# Altium schematic sheet A.SchDoc
size A
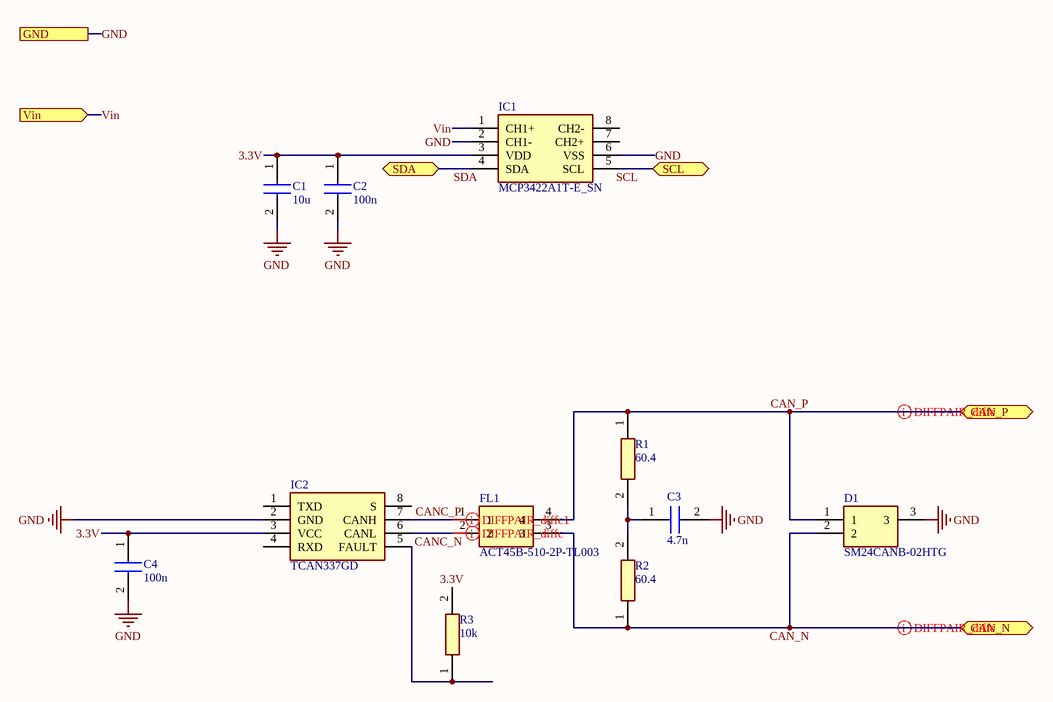
[diagram p0: A.SchDoc]

## Parts
C1  10u  [CAPC1608X90N]
C2  100n  [CAPC1608X90N]
C3  4.7n  [CAPC1608X95N]
C4  100n  [CAPC1608X90N]
D1  SM24CANB-02HTG  [SM24CANB02HTG]
FL1  ACT45B-510-2P-TL003  [ACT45B1012PTL003]
IC1  MCP3422A1T-E_SN  [SOIC127P600X175-8N]
IC2  TCAN337GD  [SOIC127P600X175-8N]
R1  60.4  [RESC1608X50N]
R2  60.4  [RESC1608X50N]
R3  10k  [RESC1608X55N]

## Ports
CAN_N (bidir), CAN_P (bidir), GND, SCL (bidir), SDA (bidir), Vin (in)

## Nets
GND: C1.2 C2.2 C3.2 C4.2 D1.3 IC1.2(CH1-) IC1.6(VSS) IC2.2(GND) ; port GND
3.3V: C1.1 C2.1 C4.1 IC1.3(VDD) IC2.3(VCC) R3.2
CAN_N: D1.2 FL1.3 R2.1 ; port CAN_N
CAN_P: D1.1 FL1.4 R1.1 ; port CAN_P
CANC_N: FL1.2 IC2.6(CANL)
CANC_P: FL1.1 IC2.7(CANH)
SCL: IC1.5(SCL) ; port SCL
SDA: IC1.4(SDA) ; port SDA
Vin: IC1.1(CH1+) ; port Vin
NetC3_1: C3.1 R1.2 R2.2
NetIC2_5: IC2.5(FAULT) R3.1

Not connected (* = marked no-connect by the designer): IC1 7(CH2+) 8(CH2-); IC2 1(TXD) 4(RXD) 8(S)

## Layout directives
differential pair; differential pair class diffc; differential pair: CAN_N, CAN_P, CANC_N
differential pair; differential pair class diffc1; differential pair: CANC_P

## Library data of the parts
C1 = CL10A106KQ8NNNL: Capacitor; Manufacturer_Name: SAMSUNG; Datasheet Link: https://product.samsungsem.com/mlcc/basic-search.do?partNumber=CL10A106KQ8NNN; Height: 0.9mm; Manufacturer_Part_Number: CL10A106KQ8NNNL; Mouser Part Number: N/A; Mouser Price/Stock: https://www.mouser.com/Search/Refine.aspx?Keyword=N%2FA; Arrow Part Number: CL10A106KQ8NNNL; Arrow Price/Stock: https://www.arrow.com/en/products/cl10a106kq8nnnl/samsung-electro-mechanics
C2 C4 = 06035C104J4Z2A: Capacitor; Manufacturer_Name: Kyocera AVX; Datasheet Link: https://componentsearchengine.com/Datasheets/1/06031A100FAT2A.pdf; Height: 0.9mm; Manufacturer_Part_Number: 06035C104J4Z2A; Mouser Part Number: 581-06035C104J4Z2A; Mouser Price/Stock: https://www.mouser.co.uk/ProductDetail/KYOCERA-AVX/06035C104J4Z2A?qs=Awwwc1gvTnlncvTGCFZvkw%3D%3D; Arrow Part Number: 06035C104J4Z2A; Arrow Price/Stock: https://www.arrow.com/en/products/06035c104j4z2a/avx
C3 = 0603B472M500CT: Capacitor; Manufacturer_Name: Walsin Technology Corporation; Datasheet Link: https://www.passivecomponent.com/wp-content/uploads/datasheet/WTC_MLCC_General_Purpose.pdf; Height: 0.95mm; Manufacturer_Part_Number: 0603B472M500CT
D1 = SM24CANB-02HTG: TVS Diode (Bi-directional); Manufacturer_Name: LITTELFUSE; Datasheet Link: https://www.littelfuse.com/products/overvoltage-protection/tvs-diode-arrays/general-purpose/sm24canb/sm24canb-02htg; Height: 1.12mm; Manufacturer_Part_Number: SM24CANB-02HTG; Mouser Part Number: 576-SM24CANB-02HTG; Mouser Price/Stock: https://www.mouser.co.uk/ProductDetail/Littelfuse/SM24CANB-02HTG?qs=bWsWnctWn1wbKmCYlcUmHw%3D%3D; Arrow Part Number: SM24CANB-02HTG; Arrow Price/Stock: https://www.arrow.com/en/products/sm24canb-02htg/littelfuse?utm_currency=USD&region=nac
FL1 = ACT45B-510-2P-TL003: Filter; Manufacturer_Name: TDK; Datasheet Link: https://product.tdk.com/system/files/dam/doc/product/emc/emc/cmf_cmc/catalog/cmf_automotive_signal_act45b_en.pdf; Height: 3mm; Manufacturer_Part_Number: ACT45B-510-2P-TL003; Mouser Part Number: 810-ACT45B5102PTL003; Mouser Price/Stock: https://www.mouser.co.uk/ProductDetail/TDK/ACT45B-510-2P-TL003?qs=U1cgCdF9Le9LCroNYLqljw%3D%3D; Arrow Part Number: ACT45B-510-2P-TL003; Arrow Price/Stock: https://www.arrow.com/en/products/act45b-510-2p-tl003/tdk?utm_currency=USD&region=nac
IC1 = MCP3422A1T-E_SN: Integrated Circuit; Manufacturer_Name: Microchip; Manufacturer_Part_Number: MCP3422A1T-E/SN; Datasheet Link: https://ww1.microchip.com/downloads/en/DeviceDoc/22088c.pdf; Height: 1.75mm; Mouser Part Number: 579-MCP3422A1T-E/SN; Mouser Price/Stock: https://www.mouser.co.uk/ProductDetail/Microchip-Technology/MCP3422A1T-E-SN?qs=X98pPdo4MrvBbe3HwfJ%252Bfw%3D%3D; Arrow Part Number: MCP3422A1T-E/SN; Arrow Price/Stock: https://www.arrow.com/en/products/mcp3422a1t-esn/microchip-technology
IC2 = TCAN337GD: Integrated Circuit; Manufacturer_Name: Texas Instruments; Datasheet Link: https://www.arrow.com/en/products/tcan337gd/texas-instruments; Height: 1.75mm; Manufacturer_Part_Number: TCAN337GD; Mouser Part Number: 595-TCAN337GD; Mouser Price/Stock: https://www.mouser.co.uk/ProductDetail/Texas-Instruments/TCAN337GD?qs=gMfM3zrbS4qmjQESf%252BTgJw%3D%3D; Arrow Part Number: TCAN337GD; Arrow Price/Stock: https://www.arrow.com/en/products/tcan337gd/texas-instruments?region=europe
R1 R2 = CRCW060360R4FKEA: Resistor; Manufacturer_Name: Vishay; Datasheet Link: http://www.vishay.com/docs/20035/dcrcwe3.pdf; Height: 0.5mm; Manufacturer_Part_Number: CRCW060360R4FKEA; Mouser Part Number: 71-CRCW0603-60.4-E3; Mouser Price/Stock: https://www.mouser.co.uk/ProductDetail/Vishay-Dale/CRCW060360R4FKEA?qs=6fyMJ9%2FiJ9KMVX8MBWVfDg%3D%3D; Arrow Part Number: CRCW060360R4FKEA; Arrow Price/Stock: https://www.arrow.com/en/products/crcw060360r4fkea/vishay
R3 = CRGCQ0603F10K: Resistor; Manufacturer_Name: TE Connectivity; Datasheet Link: https://www.te.com/commerce/DocumentDelivery/DDEController?Action=showdoc&DocId=Data+Sheet%7F1773204-3%7F1%7Fpdf%7FEnglish%7FENG_DS_1773204-3_1.pdf%7F5-2176339-2; Height: 0.55mm; Manufacturer_Part_Number: CRGCQ0603F10K; Mouser Part Number: 279-CRGCQ0603F10K; Mouser Price/Stock: https://www.mouser.co.uk/ProductDetail/TE-Connectivity-Holsworthy/CRGCQ0603F10K?qs=wUXugUrL1qxhM765MzQWJg%3D%3D; Arrow Part Number: CRGCQ0603F10K; Arrow Price/Stock: https://www.arrow.com/en/products/crgcq0603f10k/te-connectivity?region=nac